# EAGLE design uBristleBot (EAGLE 7.3.0)
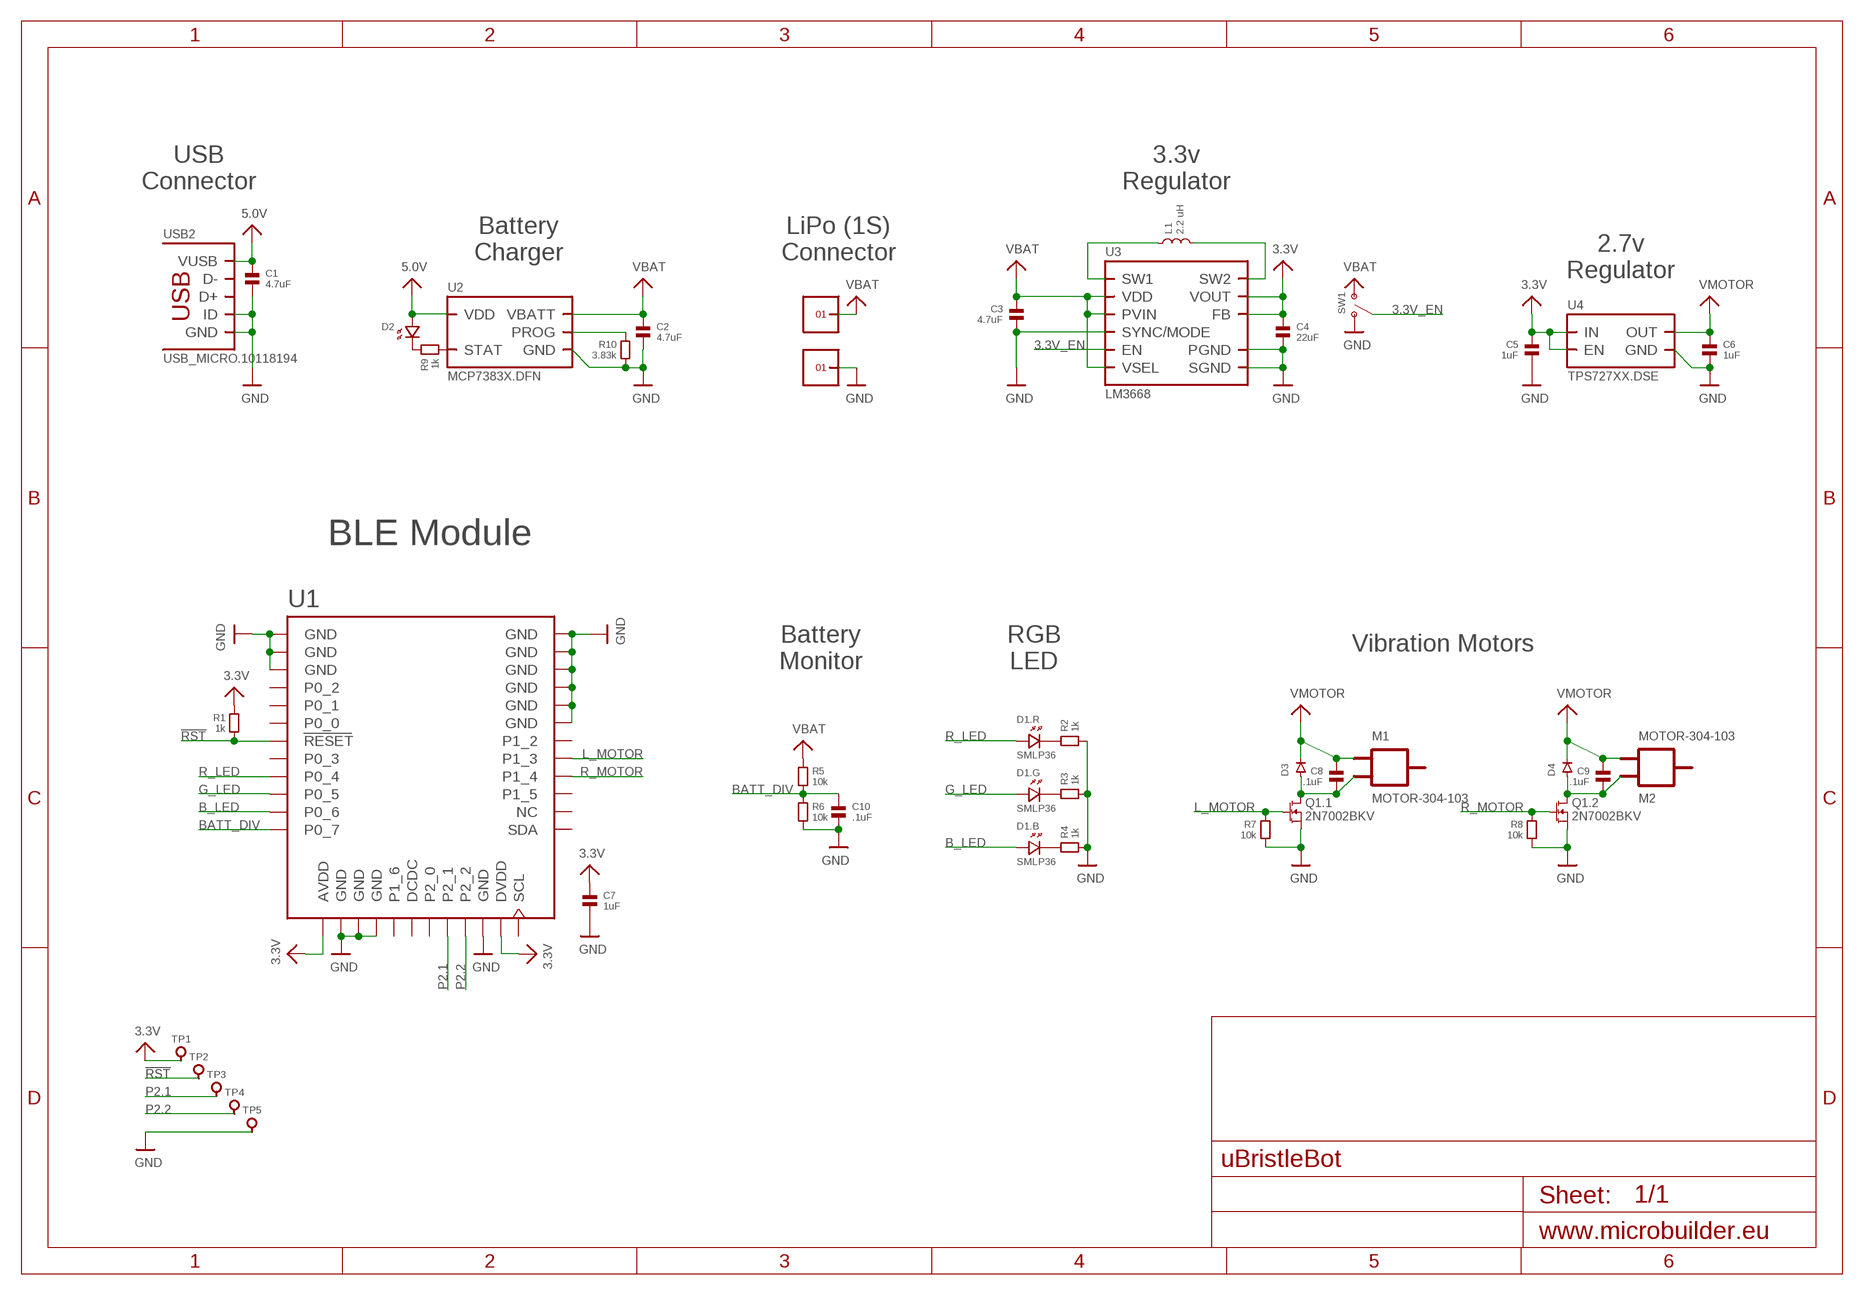
[diagram p0: schematic, sheet 1]

## Parts
C1  4.7uF  CAPACITOR.0603  [0603]
C2  4.7uF  CAPACITOR.0603  [0603]
C3  4.7uF  CAPACITOR.0603  [0603]
C4  22uF  CAPACITOR.0603  [0603]
C5  1uF  CAPACITOR.0402  [0402]
C6  1uF  CAPACITOR.0402  [0402]
C7  1uF  CAPACITOR.0402  [0402]
C8  .1uF  CAPACITOR.0402  [0402]
C9  .1uF  CAPACITOR.0402  [0402]
C10  .1uF  CAPACITOR.0402  [0402]
D1  SMLP36  [0604]
D2  LED.0402  [0402.LED]
D3  DIODE.SOD-523F  [SOD-523F]
D4  DIODE.SOD-523F  [SOD-523F]
L1  2.2 uH  INDUCTOR-SDR0403  [SDR0403]
M1  MOTOR-304-103  [304-103]
M2  MOTOR-304-103  [304-103]
Q1  2N7002BKV  [SOT666]
R1  1k  RESISTOR.0402  [0402]
R2  1k  RESISTOR.0402  [0402]
R3  1k  RESISTOR.0402  [0402]
R4  1k  RESISTOR.0402  [0402]
R5  10k  RESISTOR.0402  [0402]
R6  10k  RESISTOR.0402  [0402]
R7  10k  RESISTOR.0402  [0402]
R8  10k  RESISTOR.0402  [0402]
R9  1k  RESISTOR.0402  [0402]
R10  3.83k  RESISTOR.0402  [0402]
SW1  SSAJ110100  [SSAJ110100]
TP1  PCB_PAD.42MIL  [0906-0_PAD]
TP2  PCB_PAD.42MIL  [0906-0_PAD]
TP3  PCB_PAD.42MIL  [0906-0_PAD]
TP4  PCB_PAD.42MIL  [0906-0_PAD]
TP5  PCB_PAD.42MIL  [0906-0_PAD]
U1  BLE121LR-VISUAL-A  [BLE121LR-A]
U2  MCP7383X.DFN  [DFN8-3X2.PAD]
U3  LM3668  [LLP.12.3X3MM]
U4  TPS727XX.DSE  [DSE]
U$31  1X1  [1X1]
U$34  1X1  [1X1]
USB2  USB_MICRO.10118194  [10118194]

## Nets
3.3V: C4.1 C5.1 C7.1 R1.1 TP1.PAD(PIN) U1.AVDD U1.DVDD U3.1(VOUT) U3.12(FB) U4.4(EN) U4.6(IN)
3.3V_EN: SW1.C(COM) U3.6(EN)
5.0V: C1.1 D2.P$1 U2.1(VDD) U2.2(VDD) USB2.1(VUSB)
!RST: R1.2 TP2.PAD(PIN) U1.RESET
B_LED: D1.1(.B:+) U1.P0_6
BATT_DIV: C10.1 R5.2 R6.1 U1.P0_7
G_LED: D1.3(.G:+) U1.P0_5
GND: C1.2 C2.2 C3.2 C4.2 C5.2 C6.2 C7.2 C10.2 Q1.1(.1:S) Q1.4(.2:S) R2.2 R3.2 R4.2 R6.2 R7.2 R8.2 R10.2 SW1.1(A) TP5.PAD(PIN) U1.GND U1.GND@2(GND) U1.GND@3(GND) U1.GND@4(GND) U1.GND@5(GND) U1.GND@6(GND) U1.GND@7(GND) U1.GND@8(GND) U1.GND@9(GND) U1.GND@10(GND) U1.GND@11(GND) U1.GND@12(GND) U1.GND@13(GND) U2.6(GND) U2.PAD(GND) U3.3(PGND) U3.8(SGND) U3.9(SGND) U3.10(SYNC/MODE) U3.PAD(SGND) U4.3(GND) U$34.1 USB2.4(ID) USB2.5(GND) USB2.PAD@1(GND) USB2.PAD@2(GND) USB2.PAD@3(GND) USB2.PAD@4(GND) USB2.PAD@5(GND) USB2.PAD@6(GND) USB2.PAD@7(GND) USB2.PAD@8(GND) USB2.PAD@9(GND) USB2.PAD@10(GND) USB2.PAD@11(GND) USB2.PAD@12(GND) USB2.PAD@13(GND) USB2.PAD@14(GND) USB2.PAD@15(GND) USB2.PAD@16(GND)
L_MOTOR: Q1.2(.1:G) R7.1 U1.P1_3
N$2: D1.5(.R:-) R2.1
N$3: D1.4(.G:-) R3.1
N$4: D1.6(.B:-) R4.1
N$5: L1.1 U3.4(SW1)
N$6: C8.2 D3.A M1.2 Q1.6(.1:D)
N$8: C9.2 D4.A M2.1 Q1.3(.2:D)
N$9: R9.2 U2.5(STAT)
N$10: D2.P$2 R9.1
N$11: R10.1 U2.8(PROG)
N$12: L1.2 U3.2(SW2)
P2.1: TP3.PAD(PIN) U1.P2_1
P2.2: TP4.PAD(PIN) U1.P2_2
R_LED: D1.2(.R:+) U1.P0_4
R_MOTOR: Q1.5(.2:G) R8.1 U1.P1_4
VBAT: C2.1 C3.1 R5.1 SW1.2(B) U2.3(VBATT) U2.4(VBATT) U3.5(PVIN) U3.7(VDD) U3.11(VSEL) U$31.1
VMOTOR: C6.1 C8.1 C9.1 D3.C D4.C M1.1 M2.2 U4.1(OUT)
Unconnected: U1.DCDC U1.NC U1.P0_0 U1.P0_1 U1.P0_2 U1.P0_3 U1.P1_2 U1.P1_5 U1.P1_6 U1.P2_0 U1.SCL U1.SDA USB2.2(D-) USB2.3(D+)

## Notes on the sheet
- USB
  Connector
- 3.3v
  Regulator
- Battery
  Charger
- LiPo (1S)
  Connector
- 2.7v
  Regulator
- BLE Module
- Vibration Motors
- Battery
  Monitor
- RGB
  LED

## Library data of the parts
C1-C10 = standardparts:CAPACITOR
D1 = ROHM:SMLP36
D2 = standardparts:LED
D3 D4 = fairchild:DIODE
L1 = bourns:INDUCTOR
M1 M2 = PrecisionMicrodrives:MOTOR
Q1 = nxp:2N7002BKV
R1-R10 = standardparts:RESISTOR
SW1 = alps:SSAJ110100
TP1-TP5 = mil_max:PCB_PAD
U1 = sf-bluegiga:BLE121LR-VISUAL: Bluetooth Low Energy single-mode long-range module - Bluetooth 4.0 (CC2541). BLE121LR-A variant has an on-module ceramic chip antenna. BLE121LR-A variant includes keepout/restrict area. Antenna edge of the module should be flush up against the edge of the PCB. See datasheet for variant layout details. IT IS EXTREMELY IMPORTANT THAT YOU FOLLOW THE LAYOUT GUIDELINES FOR THIS MODULE IN ORDER TO ENSURE MAXIMUM RANGE. THIS MEANS THAT YOU NEED A SOLID GROUND PLANE EXTENDING AT LEAST 17 mm ON THE LEFT AND RIGHT SIDES OF THE MODULE, AS SHOWN IN THE DATASHEET. BLE121LR is a Bluetooth Smart Long Range module targeted for Bluetooth Smart applications where the best possible RF performance and range are required. At +8 dBm TX power and -98 dBm sensitivity BLE121LR has best-in-class RF performance and can provide Bluetooth Smart connectivity up to 450 meters. BLE121LR integrates all features required for a Bluetooth Smart application: Bluetooth radio, software stack and GATT based profiles. and it can also host end user applications, which means no external micro controller is required in size, price or power constrained devices. BLE121LR Bluetooth Smart module also has flexible hardware interfaces to connect to different peripherals or sensors. Although BLE121LR Bluetooth Smart Long Range Module is target for applications requiring high RF performance, it is still has relatively low power consumption and can be power using a standard 3V coin cell batteries. https://www.bluegiga.com/en-US/products/bluetooth-4.0-modules/ble121lr-bluetooth--smart-long https://github.com/jrowberg/sf-oshw Last updated 2014-08-02 by Jeff Rowberg <jeff@rowberg.net>; ANTENNA: On-module ceramic chip antenna
U2 = microchip:MCP7383X
U3 = packages(ti):LM3668
U4 = packages(ti):TPS727XX
U$31 U$34 = headers.edge(.1in):1X1
USB2 = FCI:USB_MICRO

## Board
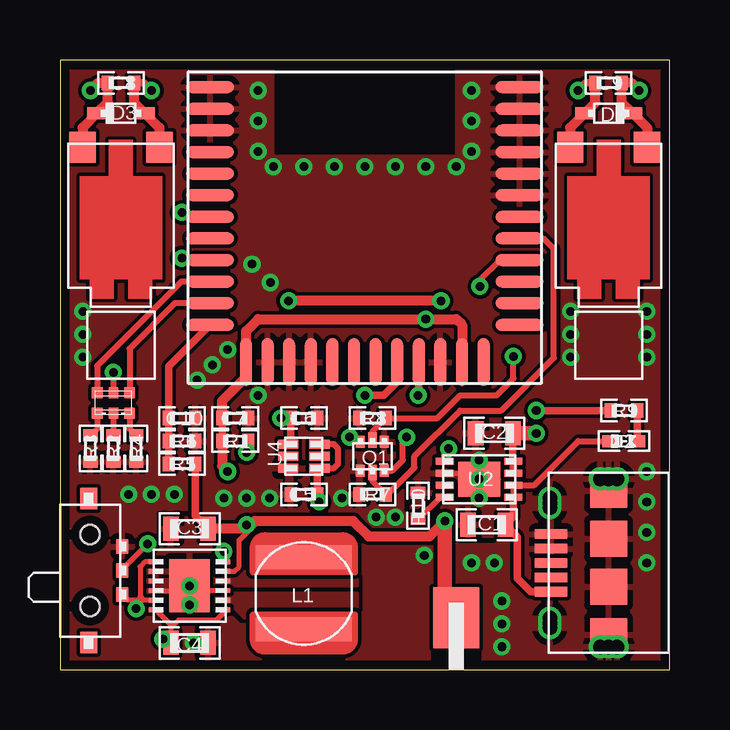
[diagram p1: board, top side]
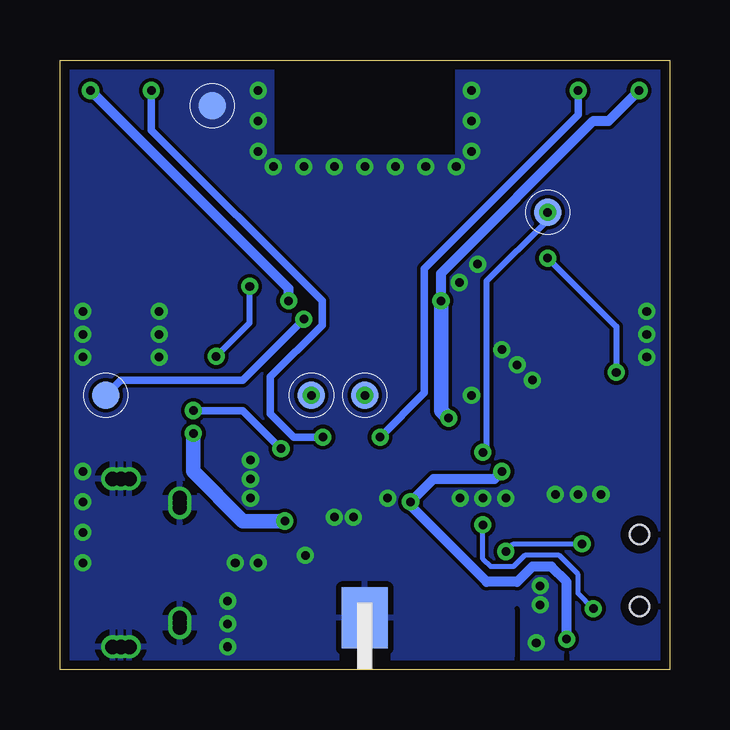
[diagram p2: board, bottom side, seen from below]

Size 25.4 x 25.4 mm. Coordinates in mm from the lower left corner, seen from the top.
Outline: 0,0 25.4,0 25.4,25.4 0,25.39 0,0
Copper layers (1*16): Top 0.0356mm / dielectric 1.5011mm / Bottom 0.0356mm
Design rules "OSHPark": minimum track width 6mil, minimum drill 13mil, track to track 6mil, track to pad 6mil, pad to pad 6mil, via to via 6mil, smd to smd 6mil, copper to edge 15mil, drill to drill 6mil, minimum pad ring 7mil, minimum via ring 7mil, stop-mask expansion 4mil, vias tented up to drill 16mil, thermal gap 10mil
tRestrict: 4 lines
bRestrict: 2 lines

### Footprints (pad centres in the part's own frame; a part is rotated, then mirrored left to right if it is on the bottom)
0603 = smd 0.65 x 1: 1 -0.775,0; 2 0.775,0
0402 = smd 0.5 x 0.6: 1 -0.55,0; 2 0.55,0
0604 = smd 0.45 x 0.45: 1 -0.675,-0.425; 3 0.675,-0.425; 4 0.675,0.425; 6 -0.675,0.425 | smd 0.4 x 0.45: 2 0,-0.425; 5 0,0.425
0402.LED = smd 0.7 x 0.5: P$1 -0.55,0; P$2 0.55,0
SOD-523F = smd 0.5 x 0.8: A 0,-1; C 0,1
SDR0403 = smd 4 x 1: 1 0,1.5; 2 0,-1.5
304-103 = smd 1.1 x 1.3: 1 -1.6,3.35; 2 1.6,3.35
SOT666 = smd 0.5 x 0.375: 1 -0.6,0.5; 3 -0.6,-0.5; 4 0.6,-0.5; 6 0.6,0.5 | smd 0.65 x 0.35: 2 -0.675,0; 5 0.675,0
SSAJ110100 = smd 0.6 x 0.5: 1 -1,2.6; 2 1,2.6; C 0,2.6 | smd 0.9 x 0.7: PAD@1 3,1.2; PAD@2 -3,1.2 | hole 0.8: -1.5,1.25; 1.5,1.25
0906-0_PAD = smd 1.143 x 1.143: PAD 0,0
BLE121LR-A = smd 0.5 x 2: AVDD -4.95,-5.6; DCDC -0.45,-5.6; DVDD 4.05,-5.6; GND@4 -4.05,-5.6; GND@5 -3.15,-5.6; GND@6 -2.25,-5.6; GND@7 3.15,-5.6; P1_6 -1.35,-5.6; P2_0 0.45,-5.6; P2_1 1.35,-5.6; P2_2 2.25,-5.6; SCL 4.95,-5.6 | smd 2 x 0.5: GND -6.45,5.85; GND@2 -6.45,4.95; GND@3 -6.45,4.05; GND@8 6.45,1.35; GND@9 6.45,2.25; GND@10 6.45,3.15; GND@11 6.45,4.05; GND@12 6.45,4.95; GND@13 6.45,5.85; NC 6.45,-3.15; P0_0 -6.45,1.35; P0_1 -6.45,2.25; P0_2 -6.45,3.15; P0_3 -6.45,-0.45; P0_4 -6.45,-1.35; P0_5 -6.45,-2.25; P0_6 -6.45,-3.15; P0_7 -6.45,-4.05; P1_2 6.45,0.45; P1_3 6.45,-0.45; P1_4 6.45,-1.35; P1_5 6.45,-2.25; RESET -6.45,0.45; SDA 6.45,-4.05
DFN8-3X2.PAD = smd 0.75 x 0.3: 1 -1.425,0.75; 2 -1.425,0.25; 3 -1.425,-0.25; 4 -1.425,-0.75; 5 1.425,-0.75; 6 1.425,-0.25; 7 1.425,0.25; 8 1.425,0.75 | smd 1.75 x 1.45: PAD 0,0
LLP.12.3X3MM = smd 0.2 x 0.6: 1 -1,-1.4; 2 -0.6,-1.4; 3 -0.2,-1.4; 4 0.2,-1.4; 5 0.6,-1.4; 6 1,-1.4; 7 1,1.4; 8 0.6,1.4; 9 0.2,1.4; 10 -0.2,1.4; 11 -0.6,1.4; 12 -1,1.4 | smd 2.2 x 1.68: PAD 0,0
DSE = smd 0.85 x 0.38: 1 -0.65,0.5; 2 -0.65,0; 3 -0.65,-0.5; 4 0.65,-0.5; 5 0.65,0; 6 0.65,0.5
1X1 = smd 1.905 x 2.54: 1 0,-2.159
10118194 = smd 0.4 x 1.35: 1 -1.2,2.4; 2 -0.6,2.4; 3 0,2.4; 4 0.6,2.4; 5 1.2,2.4 | smd 1.5 x 1.55: PAD@1 -1,0; PAD@2 1,0 | smd 1.4 x 1.55: PAD@3 -3,0; PAD@4 3,0 | drill 0.6: PAD@5 -3.5,-0.35; PAD@6 -3.5,0; PAD@7 -3.5,0.35; PAD@8 3.5,0.35; PAD@9 3.5,0; PAD@10 3.5,-0.35; PAD@11 2.7,2.45; PAD@12 2.5,2.45; PAD@13 2.3,2.45; PAD@14 -2.3,2.45; PAD@15 -2.5,2.45; PAD@16 -2.7,2.45

### Placement (x,y rotation side)
C1  17.78,6.03 180 top
C2  18.1,9.84 180 top
C3  5.4,5.87 180 top
C4  5.4,1.11 0 top
C5  10.16,7.3 180 top
C6  10.16,10.48 0 top
C7  7.3,10.48 0 top
C8  2.54,24.45 0 top
C9  22.86,24.45 180 top
C10  5.08,10.48 0 top
D1  2.22,11.11 180 top
D2  23.5,9.53 0 top
D3  2.54,23.18 90 top
D4  22.86,23.18 270 top
L1  10.16,3.17 0 top
M1  2.54,18.41 0 top
M2  22.86,18.41 0 top
Q1  13.02,8.89 90 top
R1  7.3,9.53 0 top
R2  2.22,9.21 270 top
R3  1.27,9.21 270 top
R4  3.17,9.21 270 top
R5  5.08,8.57 180 top
R6  5.08,9.53 0 top
R7  13.02,7.3 180 top
R8  13.02,10.48 180 top
R9  23.5,10.79 180 top
R10  14.92,6.83 90 top
SW1  0,4.13 270 top
TP1  23.5,11.43 0 bottom
TP2  5.08,19.05 0 bottom
TP3  12.7,11.43 0 bottom
TP4  14.92,11.43 0 bottom
TP5  19.05,23.5 0 bottom
U1  12.7,18.41 0 top
U2  17.46,7.94 180 top
U3  5.4,3.49 90 top
U4  10.16,8.89 0 top
U$31  16.51,0 180 top
U$34  12.7,0 180 bottom
USB2  22.86,4.45 90 top

### Tracks (layer width: path | path; a pad name or v marks a point on that pad's centre or on a via)
3.3V  (via drill 0.36)
  Top 0.203: U3.12 4.62,1.87 4.62,1.75 | 4.62,1.75 C4.1 | U3.1 6.8,2.35 6.51,2.06 4.94,2.06 4.62,1.75
  Top 0.254: U4.4 11.41,8.39 11.59,8.57 11.59,9.21 11.41,9.39 U4.6
  Top 0.305: C7.1 R1.1 | U4.4 10.71,8.29 C5.1 10.71,7.07 v10.79,6.99
  Top 0.406: C4.1 4.45,1.11 v4.29,1.27 | R1.1 6.75,8.49 v6.99,8.26 | C7.1 6.75,11.2 7.75,12.2 U1.AVDD 7.75,14.1 8.26,14.61 v15.24,14.61 16.51,14.61 16.75,14.37 U1.DVDD
  Bottom 0.305: TP1.PAD 22.86,12.06 17.78,12.06 v15.24,14.61
  Bottom 0.406: v4.29,1.27 4.29,3.65 4.92,4.29 5.71,4.29 6.35,3.65 7.62,3.65 10.79,6.83 v10.79,6.99 9.84,7.94 7.3,7.94 v6.99,8.26
3.3V_EN  (via drill 0.36)
  Top 0.203: U3.6 6.83,4.52 v6.83,4.92 | v3.65,5.24 2.6,4.19 SW1.C
  Bottom 0.203: v6.83,4.92 6.51,5.24 v3.65,5.24
5.0V
  Top 0.254: U2.1 U2.2 19.75,7.69 21.59,9.53 D2.P$1
  Top 0.305: USB2.1 19.61,3.25 19.05,3.81 19.05,5.54 C1.1 18.89,6.37 U2.1
!RST  (via drill 0.36)
  Top 0.254: R1.2 7.78,9.45 v7.78,9.05
  Top 0.305: U1.RESET 5.26,18.86 TP2.PAD
  Bottom 0.254: v7.78,9.05 7.62,9.21 7.62,16.19 5.08,18.73 TP2.PAD
  other vias: 5.08,19.05
B_LED
  Top 0.254: U1.P0_6 4.79,15.27 2.9,13.38 D1.1
BATT_DIV
  Top 0.305: U1.P0_7 4.53,12.64 C10.1 R6.1 R5.2
G_LED
  Top 0.254: U1.P0_5 5.05,16.16 1.55,12.66 D1.3
GND  (via drill 0.36)
  Top 0.203: U3.3 5.6,3.29 U3.PAD 5.2,3.29 U3.10 | U2.6 17.21,8.19 U2.PAD
  other vias: 5.56,1.11 5.4,3.49 5.4,2.7 15.18,4.76 8.26,24.13 8.26,22.86 8.26,21.59 8.89,20.95 10.16,20.95 11.43,20.95 12.7,20.95 13.97,20.95 15.24,20.95 16.51,20.95 17.14,21.59 17.14,22.86 17.14,24.13 17.46,7.94 17.46,8.73 17.46,7.14 8.26,11.43 8.73,7.14 7.78,7.14 6.83,7.14 11.75,7.14 13.97,6.35 13.18,6.35 8.76,16.13 8,16.89 6.99,13.34 6.35,12.7 5.71,12.06 0.95,14.92 0.95,13.97 0.95,13.02 24.45,14.92 24.45,13.97 24.45,13.02 21.27,14.92 21.27,13.97 21.27,13.02 17.14,4.45 18.41,0.95 18.41,1.91 18.41,2.86 18.1,4.45 24.45,6.99 24.45,5.71 24.45,4.45 24.45,8.26 4.76,7.3 3.81,7.3 2.86,7.3
  pour Bottom (rank 6): 0,0 25.4,0 25.4,25.4 0,25.4
  pour Top (rank 6): 0,25.4 25.4,25.4 25.4,0 0,0
L_MOTOR
  Top 0.254: Q1.2 13.02,7.85 R7.1 13.65,7.3 14.76,8.41 14.76,8.89 16.67,10.79 18.38,10.79 20.57,12.99 20.57,17.53 20.14,17.96 U1.P1_3
N$2
  Top 0.254: D1.5 R2.1
N$3
  Top 0.254: D1.4 1.55,10.04 R3.1
N$4
  Top 0.254: D1.6 2.9,10.04 R4.1
N$5
  pour Top (rank 3, no thermals): 12.38,3.49 6.35,3.49 6.35,3.81 8.26,5.71 11.91,5.71 12.38,5.24
N$6  (via drill 0.36)
  Top 0.254: Q1.6 12.26,9.49 v12.06,9.68
  Top 0.305: v3.81,24.13 3.49,24.45 C8.2
  Top 0.406: M1.2 4.14,22.58 D3.A 3.09,23.63 C8.2
  Bottom 0.305: v12.06,9.68 10.22,11.53 10.22,16.7 3.81,23.11 v3.81,24.13
N$8  (via drill 0.36)
  Top 0.254: Q1.3 13.85,8.29 14.29,8.73 14.29,9.53 v14.45,9.68
  Top 0.305: v21.59,24.13 21.91,24.45 C9.2
  Top 0.406: M2.1 21.26,22.58 D4.A 22.31,23.63 C9.2
  Bottom 0.305: v21.59,24.13 21.59,22.48 14.48,15.37 14.48,14.35 16.64,12.19 16.64,10.67 15.65,9.68 v14.45,9.68
N$9  (via drill 0.36)
  Top 0.305: U2.5 16.04,9.05 v16.19,9.21 | v19.84,10.79 R9.2
  Bottom 0.305: v16.19,9.21 17.78,10.79 v19.84,10.79
N$10
  Top 0.305: R9.1 D2.P$2
N$11
  Top 0.254: U2.8 15.83,7.19 R10.1
N$12
  pour Top (rank 2, no thermals): 11.91,0.64 8.26,0.64 7.78,1.11 7.78,2.06 7.14,2.7 6.51,2.7 6.51,3.17 12.38,3.17 12.38,1.11
P2.1  (via drill 0.36)
  Top 0.305: U1.P2_1 14.05,11.99 13.49,11.43 TP3.PAD
  other vias: 12.7,11.43
P2.2  (via drill 0.36)
  Top 0.305: U1.P2_2 14.95,11.46 TP4.PAD
  other vias: 14.92,11.43
R_LED  (via drill 0.36)
  Top 0.254: v2.22,12.38 D1.2 | U1.P0_4 5.16,17.07 v5.08,17.14
  Bottom 0.254: v5.08,17.14 2.22,14.29 v2.22,12.38
R_MOTOR  (via drill 0.36)
  Top 0.254: Q1.5 13.02,9.93 R8.1 15.72,10.48 16.67,11.43 18.19,11.43 18.89,12.13 v18.89,13.05 | v17.49,15.97 17.49,16.22 18.34,17.07 U1.P1_4
  Bottom 0.254: v18.89,13.05 17.49,14.45 v17.49,15.97
VBAT  (via drill 0.36)
  Top 0.203: U3.11 3.49,2.89 | 3.49,2.89 2.83,2.89 SW1.2 | U3.7 3.54,4.49 3.33,4.29 3.33,3.05 | 3.33,3.05 3.49,2.89 | U3.5 7.27,4.09 7.46,4.29 7.46,5.4 8.26,6.19 | 3.33,3.05 3.33,2.7 v3.17,2.54 | v7.78,6.03 7.78,5.87
  Top 0.305: U2.3 U2.4 18.87,8.7 C2.1 | C3.1 5.63,6.42 R5.1
  Top 0.406: U$31.1 16.51,2.54 | C3.1 7.78,5.87 8.1,6.19 8.26,6.19 12.22,6.19 12.86,5.56 15.4,5.56 v16.03,6.19
  Top 0.61: U$31.1 16.03,2.63 v16.03,6.19 | v19.84,9.84 C2.1
  Bottom 0.203: v3.17,2.54 3.81,3.17 3.81,3.97 4.6,4.76 6.03,4.76 6.51,4.29 7.46,4.29 7.78,4.6 v7.78,6.03
  Bottom 0.61: v16.03,6.19 17.78,6.19 19.84,8.26 v19.84,9.84
VMOTOR  (via drill 0.36)
  Top 0.305: U4.1 9.61,9.49 C6.1 v9.21,10.48
  Top 0.406: M1.1 0.94,22.58 D3.C 1.99,23.63 C8.1 1.59,24.45 v1.27,24.13 | M2.2 24.46,22.58 D4.C 23.41,23.63 C9.1 23.81,24.45 v24.13,24.13 | v15.88,15.37 v9.53,15.37
  Bottom 0.406: v1.27,24.13 2.54,22.86 3.17,22.86 9.53,16.51 v9.53,15.37 | v15.88,15.37 15.88,15.88 v24.13,24.13
  Bottom 0.61: v9.21,10.48 9.53,10.79 v9.53,15.37

### Text on the board
tDocu: VBAT
bDocu: uBristleBot | Cruz Monrreal II | TheNextPlateau.com | v0.2 | GND